# EAGLE schematic SMPS (EAGLE 6.5.0)
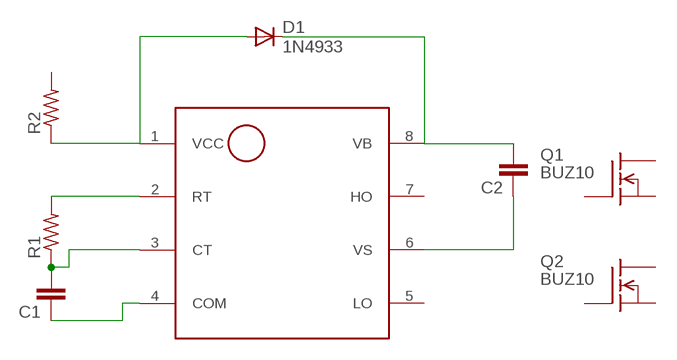
[diagram p0: schematic, sheet 1]

## Parts
C1  C-EU025-050X050  [C025-050X050]
C2  C-EU025-050X050  [C025-050X050]
D1  1N4933  [DO41-10]
Q1  BUZ10  [TO220]
Q2  BUZ10  [TO220]
R1  R-US_0309/10  [0309/10]
R2  R-US_0309/10  [0309/10]
U$1  IRS2153D  [IRS2153D]

## Nets
N$1: D1.A R2.1 U$1.1(VCC)
N$2: C2.2 D1.C U$1.8(VB)
N$3: C1.2 R1.1 U$1.3(CT)
N$4: R1.2 U$1.2(RT)
N$6: C1.1 U$1.4(COM)
N$7: C2.1 U$1.6(VS)
Unconnected: Q1.1(G) Q1.2(D) Q1.3(S) Q2.1(G) Q2.2(D) Q2.3(S) R2.2 U$1.5(LO) U$1.7(HO)

## Library data of the parts
C1 C2 = resistor:C-EU: CAPACITOR, European symbol
D1 = diode:1N4933: DIODE fast recovery rectifier, 1A
Q1 Q2 = transistor-fet:BUZ10: N-Channel Enhancement MOSFET 50V; 20A; 0,080Ohm
R1 R2 = resistor:R-US_: RESISTOR, American symbol
U$1 = Amplifier_Parts:IRS2153D